# EAGLE schematic BMSnew (EAGLE 9.4.2)
ESKD_DESCRIPTION1: 207|235|224|242|224|32|192|193; ESKD_DESCRIPTION2: 241|245|229|236|224|32|253|235|229|234|242|240|232|247|229|241|234|224|255; ESKD_DESCRIPTION3: 239|240|232|237|246|232|239|232|224|235|252|237|224|255; ESKD_NUMBER: 67|67|83|49|46|51|50|48|48|45|48|221|51; ESKD_NUMBER_SHEET: 49; ESKD_SHEETS: 49
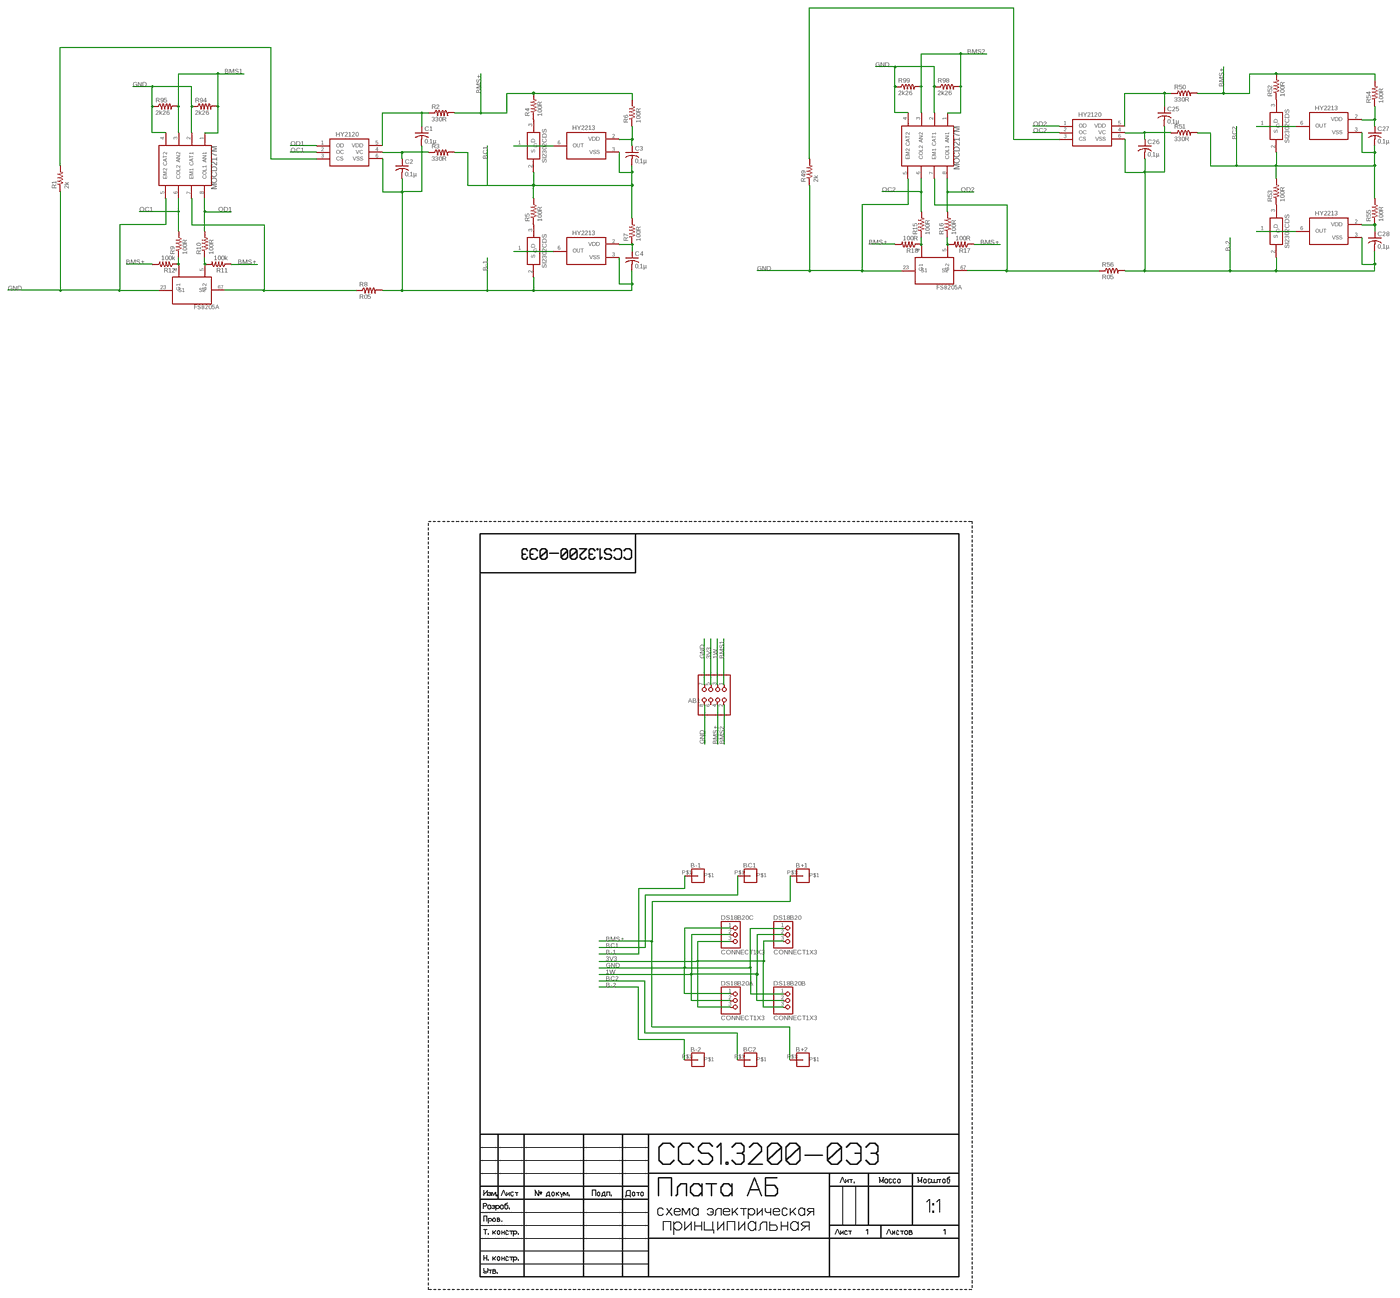
[diagram p0: schematic, sheet 1, overview]
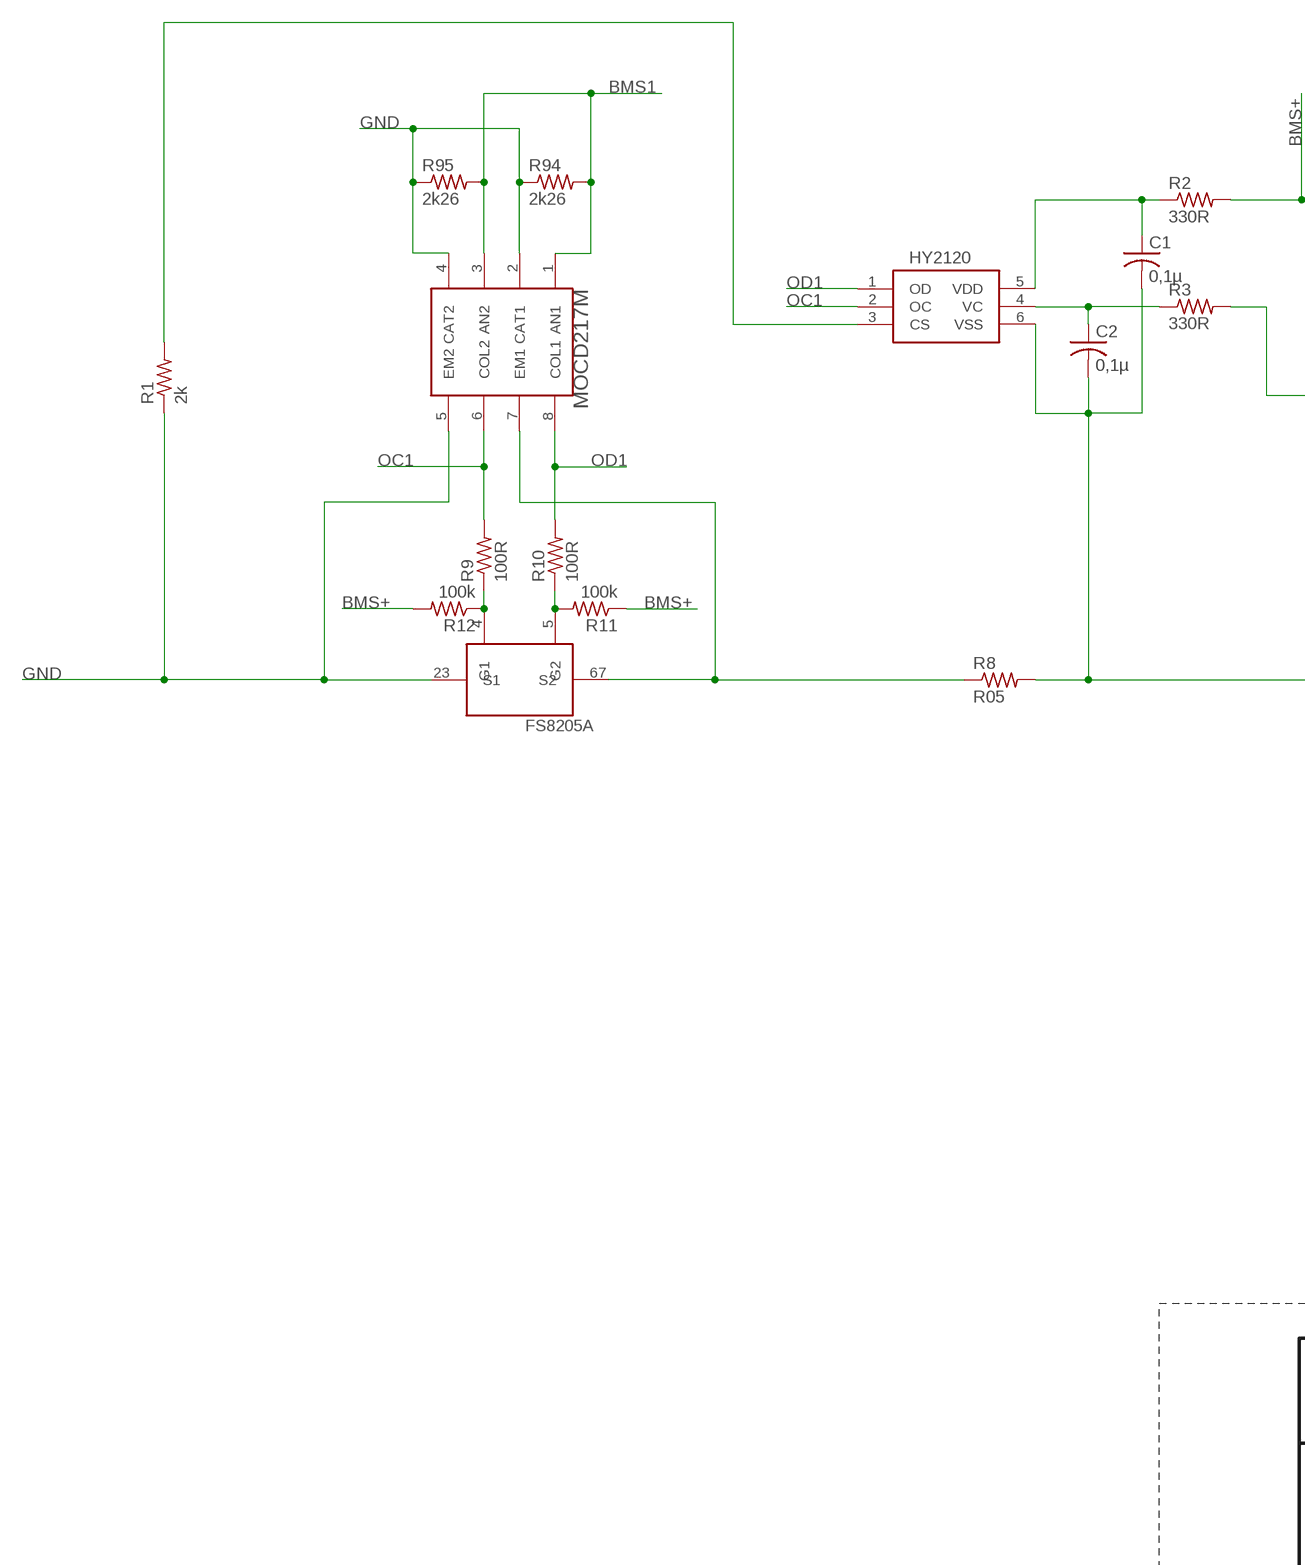
[diagram p1: schematic, sheet 1, part 1 of 4]
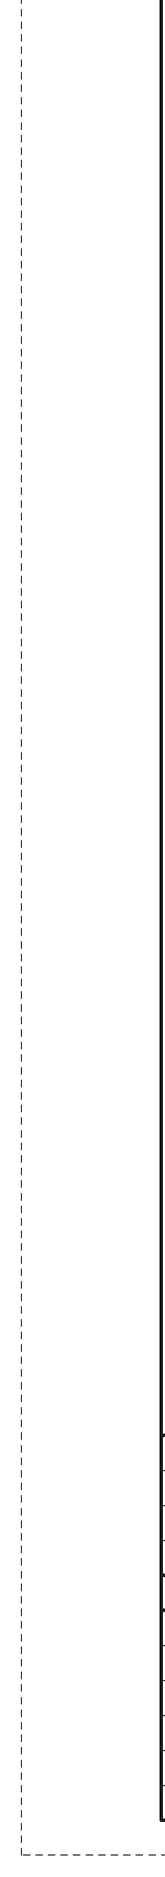
[diagram p2: schematic, sheet 1, part 2 of 4]
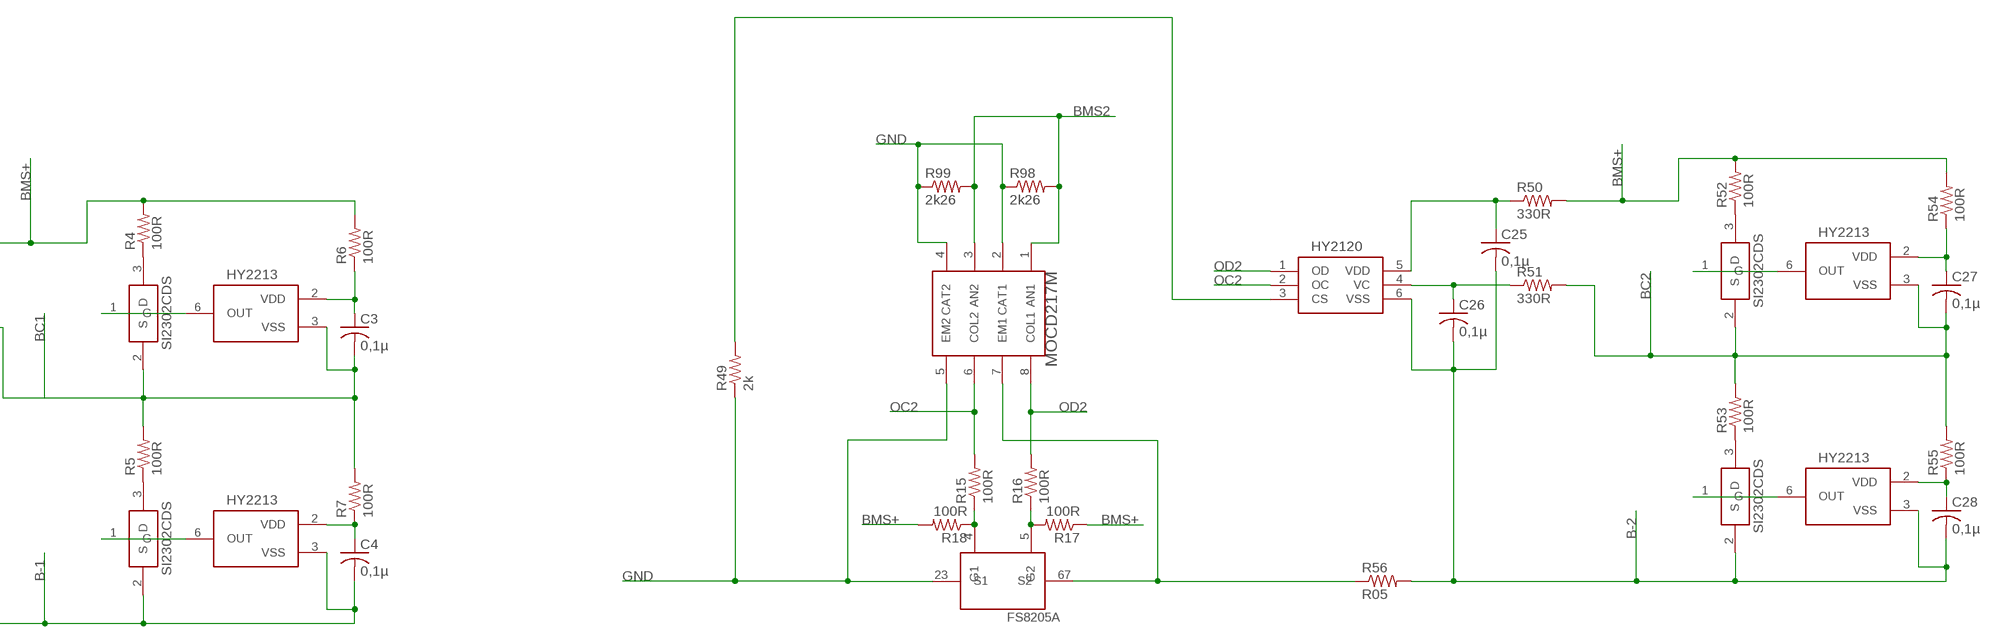
[diagram p3: schematic, sheet 1, part 3 of 4]
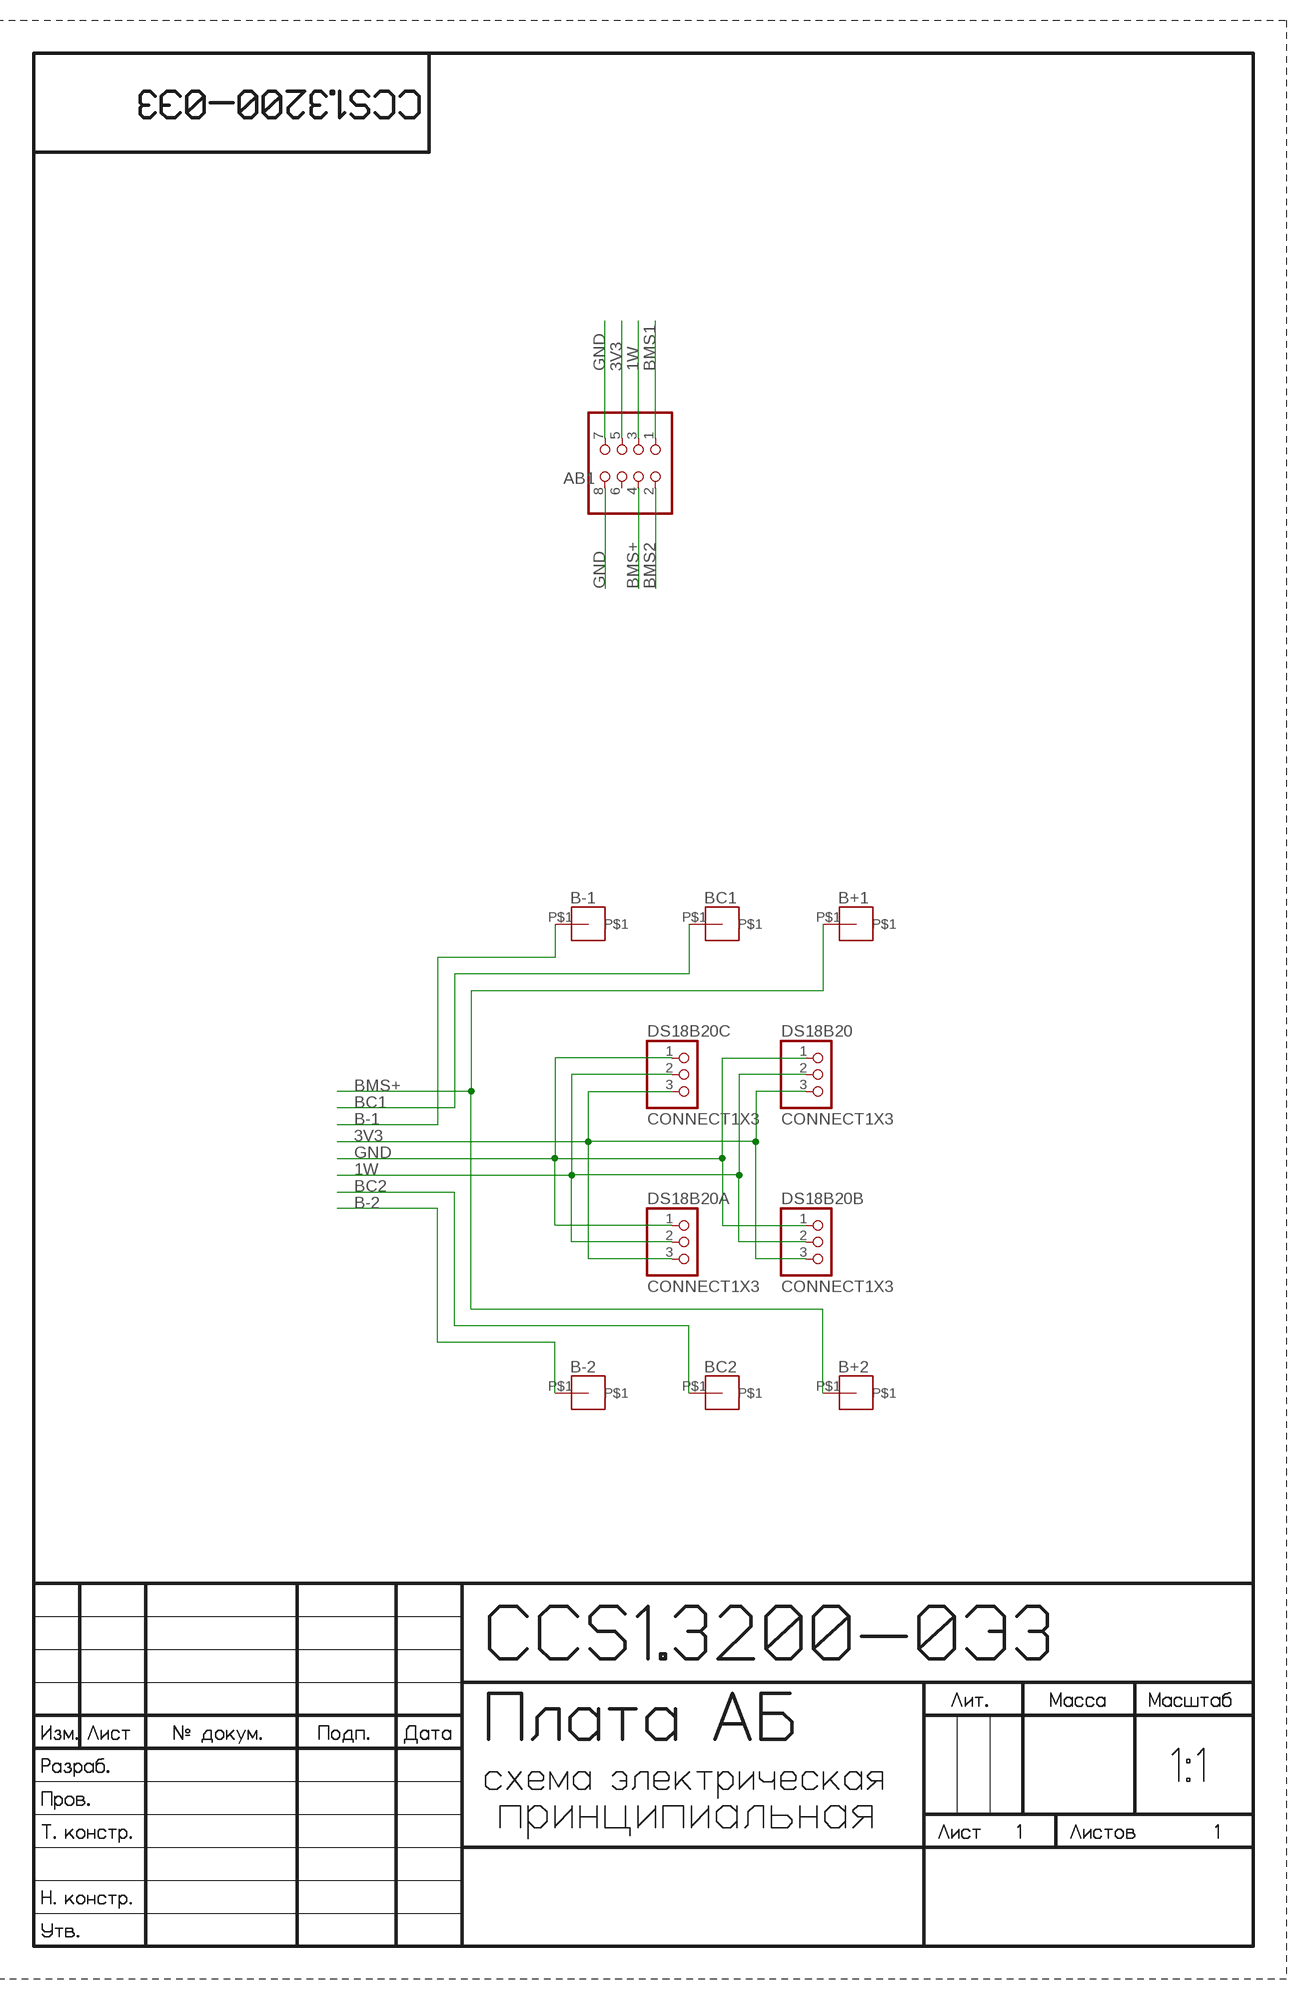
[diagram p4: schematic, sheet 1, part 4 of 4]

## Parts
AB1  PINHD-2X4  [2X04]
B+1  BATTERY  [BATTERY]
B+2  BATTERY  [BATTERY]
B-1  BATTERY  [BATTERY]
B-2  BATTERY  [BATTERY]
BC1  BATTERY  [BATTERY]
BC2  BATTERY  [BATTERY]
C1  0,1µ  C-USC0603  [C0603]
C2  0,1µ  C-USC0603  [C0603]
C3  0,1µ  C-USC0603  [C0603]
C4  0,1µ  C-USC0603  [C0603]
C25  0,1µ  C-USC0603  [C0603]
C26  0,1µ  C-USC0603  [C0603]
C27  0,1µ  C-USC0603  [C0603]
C28  0,1µ  C-USC0603  [C0603]
DS18B20  CONNECT1X3  [CONNECT1X3]
DS18B20A  CONNECT1X3  [CONNECT1X3]
DS18B20B  CONNECT1X3  [CONNECT1X3]
DS18B20C  CONNECT1X3  [CONNECT1X3]
R1  2k  R-US_R0603  [R0603]
R2  330R  R-US_R0603  [R0603]
R3  330R  R-US_R0603  [R0603]
R4  100R  R-US_R0603  [R0603]
R5  100R  R-US_R0603  [R0603]
R6  100R  R-US_R0603  [R0603]
R7  100R  R-US_R0603  [R0603]
R8  R05  R-US_R2512  [R2512]
R9  100R  R-US_R0603  [R0603]
R10  100R  R-US_R0603  [R0603]
R11  100k  R-US_R0603  [R0603]
R12  100k  R-US_R0603  [R0603]
R15  100R  R-US_R0603  [R0603]
R16  100R  R-US_R0603  [R0603]
R17  100R  R-US_R0603  [R0603]
R18  100R  R-US_R0603  [R0603]
R49  2k  R-US_R0603  [R0603]
R50  330R  R-US_R0603  [R0603]
R51  330R  R-US_R0603  [R0603]
R52  100R  R-US_R0603  [R0603]
R53  100R  R-US_R0603  [R0603]
R54  100R  R-US_R0603  [R0603]
R55  100R  R-US_R0603  [R0603]
R56  R05  R-US_R2512  [R2512]
R94  2k26  R-US_R0603  [R0603]
R95  2k26  R-US_R0603  [R0603]
R98  2k26  R-US_R0603  [R0603]
R99  2k26  R-US_R0603  [R0603]
U$1  FS8205A-  [FS8205A-]
U$2  MOCD217M  [SOIC8]
U$3  HY2120  [HY2120]
U$4  HY2213  [HY2213]
U$5  HY2213  [HY2213]
U$6  SI2302CDS  [SI2302CDS]
U$7  SI2302CDS  [SI2302CDS]
U$10  MOCD217M  [SOIC8]
U$26  FS8205A-  [FS8205A-]
U$45  HY2120  [HY2120]
U$46  HY2213  [HY2213]
U$47  HY2213  [HY2213]
U$48  SI2302CDS  [SI2302CDS]
U$49  SI2302CDS  [SI2302CDS]

## Nets
1W: AB1.3 DS18B20.2 DS18B20A.2 DS18B20B.2 DS18B20C.2
3V3: AB1.5 DS18B20.3 DS18B20A.3 DS18B20B.3 DS18B20C.3
B-1: B-1.P$1 C1.2 C2.2 C4.2 R8.2 U$3.6(VSS) U$5.3(VSS) U$7.2(S)
B-2: B-2.P$1 C25.2 C26.2 C28.2 R56.2 U$45.6(VSS) U$47.3(VSS) U$49.2(S)
BC1: BC1.P$1 C3.2 R3.2 R5.2 R7.2 U$4.3(VSS) U$6.2(S)
BC2: BC2.P$1 C27.2 R51.2 R53.2 R55.2 U$46.3(VSS) U$48.2(S)
BMS1: AB1.1 R94.2 R95.2 U$2.1(AN1) U$2.3(AN2)
BMS2: AB1.2 R98.2 R99.2 U$10.1(AN1) U$10.3(AN2)
BMS+: AB1.4 B+1.P$1 B+2.P$1 R2.2 R4.2 R6.2 R11.1 R12.2 R17.1 R18.2 R50.2 R52.2 R54.2
GND: AB1.7 AB1.8 DS18B20.1 DS18B20A.1 DS18B20B.1 DS18B20C.1 R1.1 R49.1 R94.1 R95.1 R98.1 R99.1 U$1.23(S1) U$2.2(CAT1) U$2.4(CAT2) U$2.5(EM2) U$10.2(CAT1) U$10.4(CAT2) U$10.5(EM2) U$26.23(S1)
N$1: R10.1 R11.2 U$26.5(G2)
N$2: R9.1 R12.1 U$26.4(G1)
N$3: R8.1 U$2.7(EM1) U$26.67(S2)
N$4: C1.1 R2.1 U$3.5(VDD)
N$5: R49.2 U$45.3(CS)
N$6: C3.1 R6.1 U$4.2(VDD)
N$7: U$4.6(OUT) U$6.1(G)
N$8: C4.1 R7.1 U$5.2(VDD)
N$9: U$5.6(OUT) U$7.1(G)
N$10: R16.1 R17.2 U$1.5(G2)
N$11: R4.1 U$6.3(D)
N$12: R5.1 U$7.3(D)
N$13: R1.2 U$3.3(CS)
N$14: R15.1 R18.1 U$1.4(G1)
N$15: C2.1 R3.1 U$3.4(VC)
N$16: R56.1 U$1.67(S2) U$10.7(EM1)
N$71: R52.1 U$48.3(D)
N$85: R53.1 U$49.3(D)
N$97: C25.1 R50.1 U$45.5(VDD)
N$99: C27.1 R54.1 U$46.2(VDD)
N$100: U$46.6(OUT) U$48.1(G)
N$102: U$47.6(OUT) U$49.1(G)
N$107: C26.1 R51.1 U$45.4(VC)
N$108: C28.1 R55.1 U$47.2(VDD)
OC1: R9.2 U$2.6(COL2) U$3.2(OC)
OC2: R15.2 U$10.6(COL2) U$45.2(OC)
OD1: R10.2 U$2.8(COL1) U$3.1(OD)
OD2: R16.2 U$10.8(COL1) U$45.1(OD)
Unconnected: AB1.6

## Library data of the parts
AB1 = pinheadCS:PINHD-2X4: PIN HEADER
B+1 B+2 B-1 B-2 BC1 BC2 = CanCubeSat:BATTERY
C1-C4 C25-C28 = rcl:C-US: CAPACITOR, American symbol; SPICEPREFIX: C
DS18B20 DS18B20A DS18B20B DS18B20C = CanCubeSat:CONNECT1X3
R1-R7 R9-R12 R15-R18 R49-R55 R94 R95 R98 R99 = resistor:R-US_: RESISTOR, American symbol
R8 R56 = rcl:R-US_: RESISTOR, American symbol; SPICEPREFIX: R
U$1 U$26 = CanCubeSat:FS8205A-
U$2 U$10 = CanCubeSat:MOCD217M
U$3 U$45 = CanCubeSat:HY2120
U$4 U$5 U$46 U$47 = CanCubeSat:HY2213
U$6 U$7 U$48 U$49 = CanCubeSat:SI2302CDS